# EasyEDA schematic LcsNodes-Main-Controller-Board-A.02.04.json
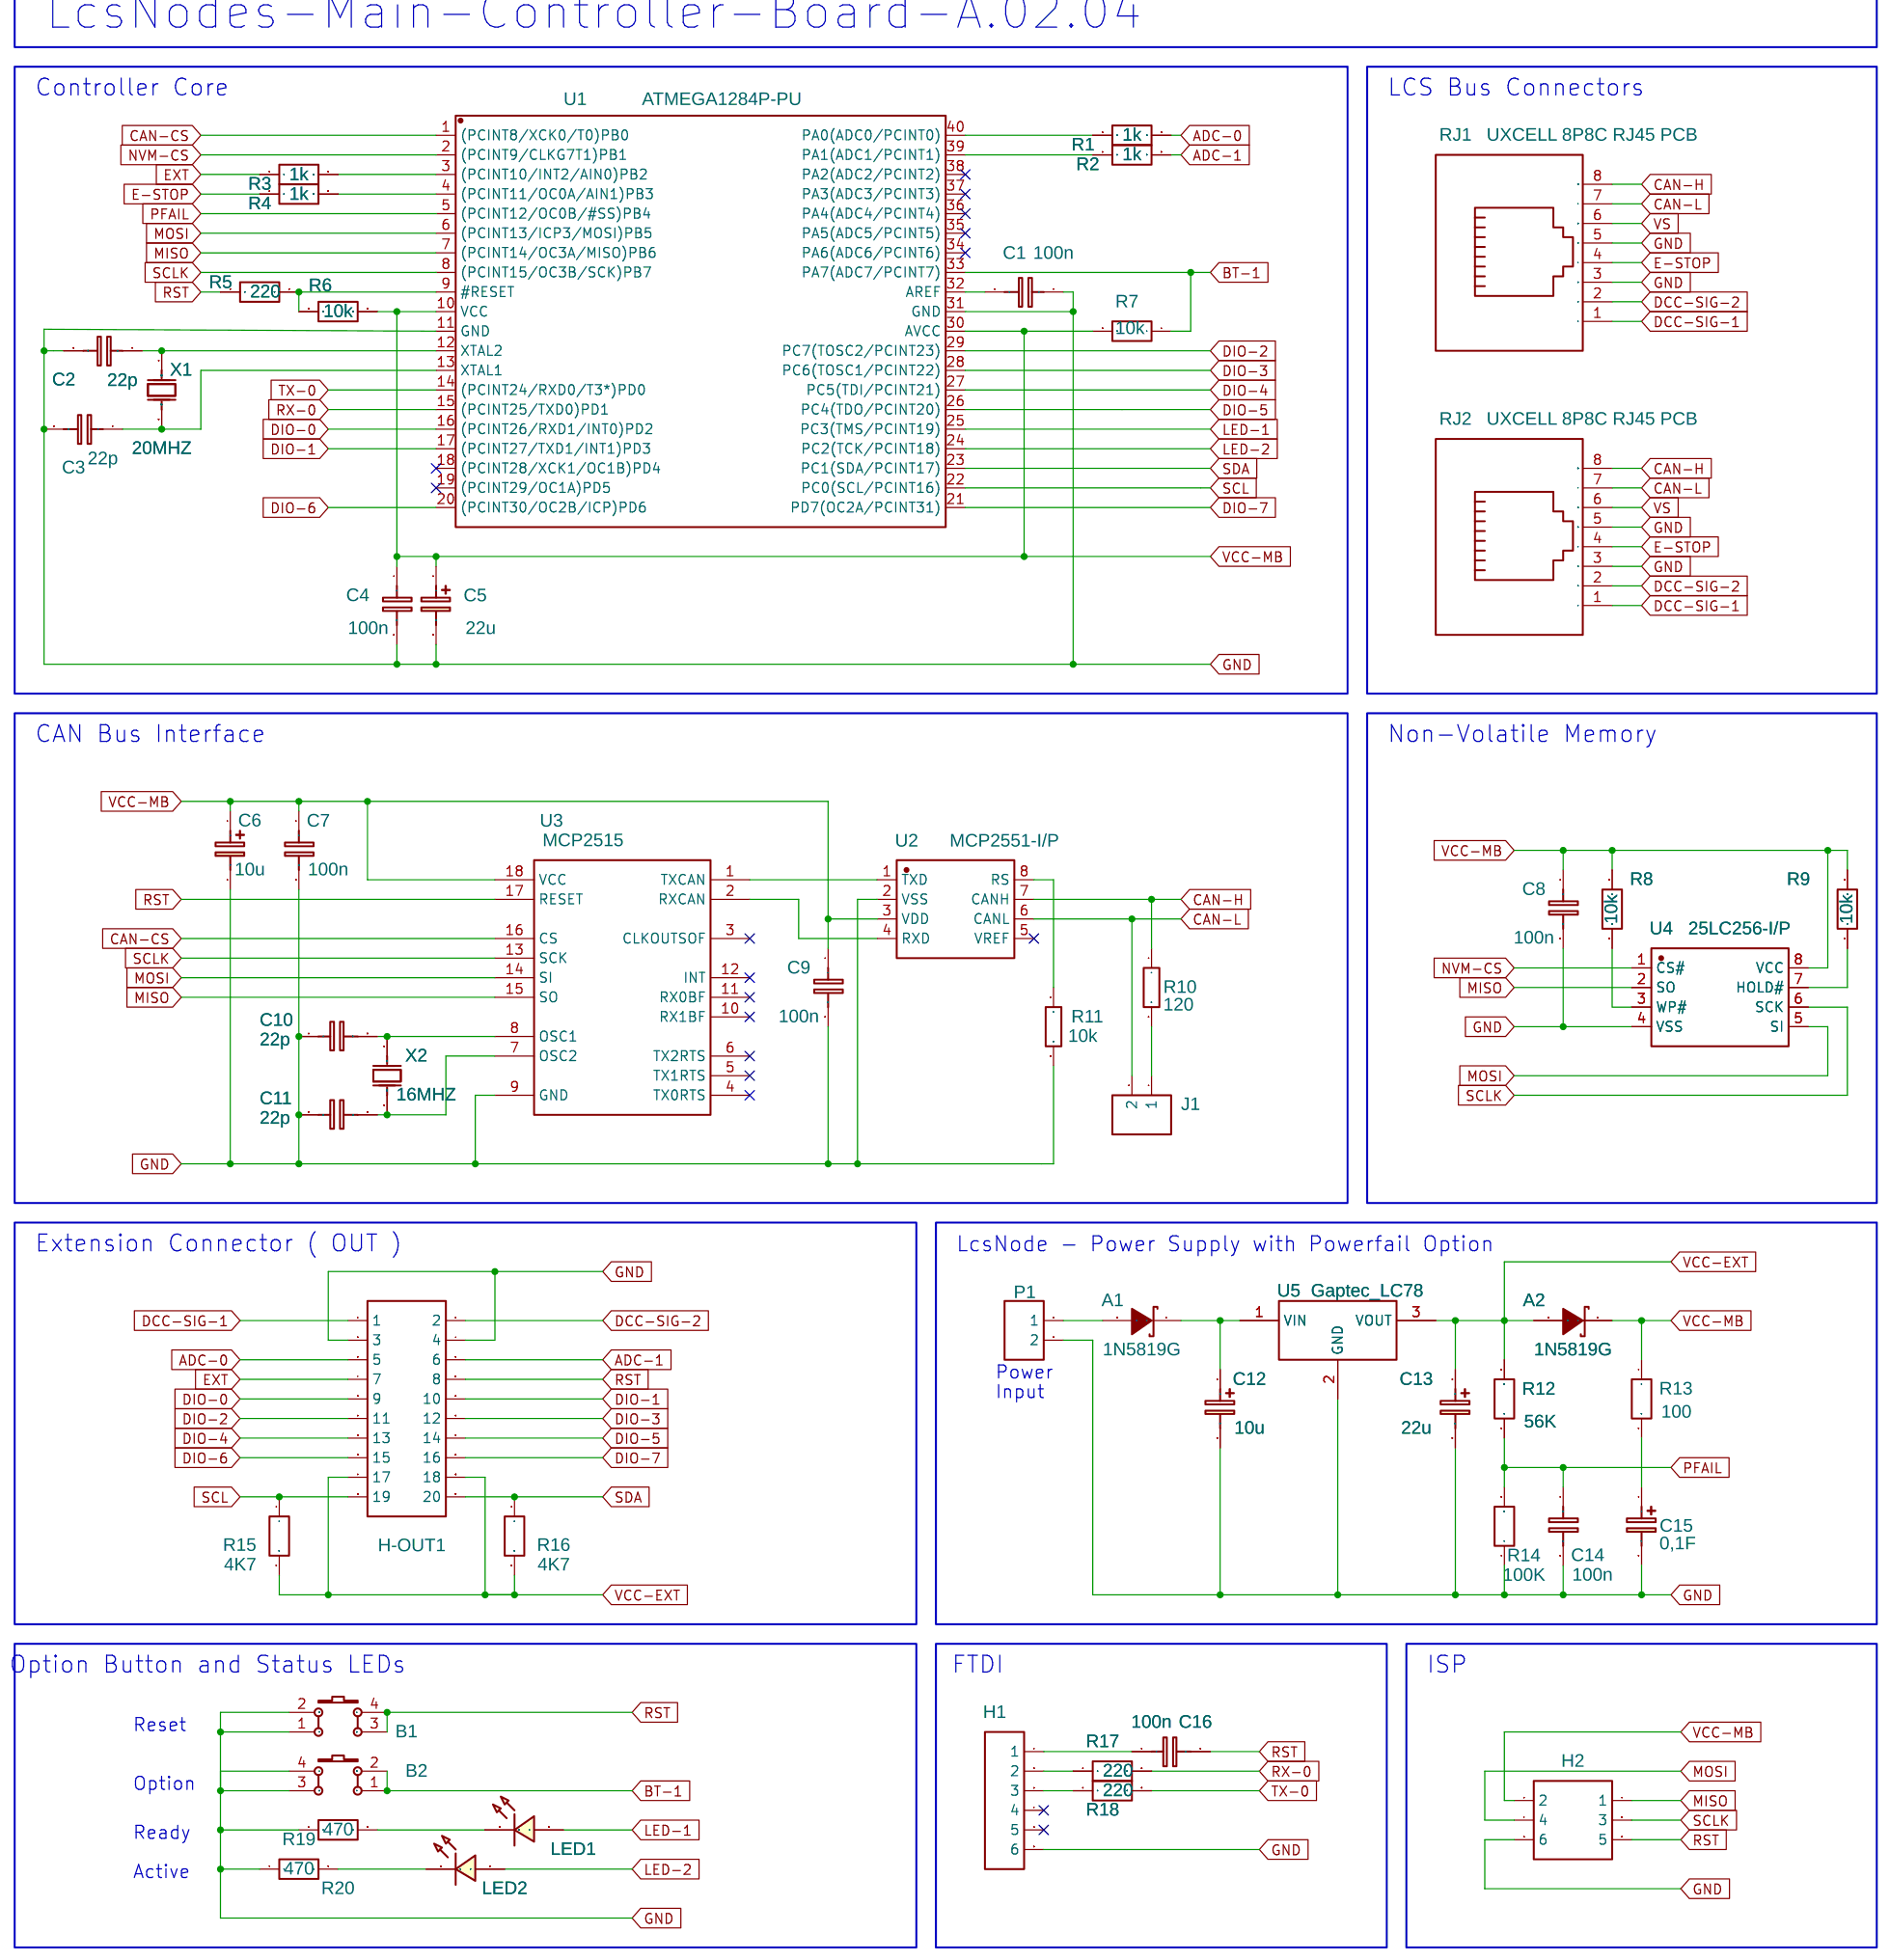
[diagram p0: schematic sheet]

## Parts
A1  1N5819G  [DO-41]
A2  1N5819G  [DO-41]
B1  Reset  [KEY-TH_4P-L6.0-W6.0-P4.50-LS6.5]
B2  Opt  [KEY-TH_4P-L6.0-W6.0-P4.50-LS6.5]
C1  100n  [RAD-0.1]
C2  22p  [RAD-0.1]
C3  22p  [RAD-0.1]
C4  100n  [RAD-0.1]
C5  22u  [CAP-D4.0×F1.5]
C6  10u  [CAP-D4.0×F1.5]
C7  100n  [RAD-0.1]
C8  100n  [RAD-0.1]
C9  100n  [RAD-0.1]
C10  22p  [RAD-0.1]
C11  22p  [RAD-0.1]
C12  10u  [CAP-D4.0×F1.5]
C13  22u  [CAP-D6.3×F2.5]
C14  100n  [RAD-0.1]
C15  0,1F  [CAP-D12.5XF5.0]
C16  100n  [RAD-0.1]
H1  HDR-F-2.54_1x6  [HDR-F-2.54_1X6]
H2  HDR-F-2.54_2x3  [HDR-F-2.54_2X3]
H-OUT1  HDR-F-2.54_2x10  [HDR-F-2.54_2X10]
J1  HDR-M-2.54_1x2  [HDR-M-2.54_1X2]
LED1  LED-TH-3mm_R  [LED-TH_BD3.0_RED]
LED2  LED-TH-3mm_R  [LED-TH_BD3.0_RED]
P1  CONN-TH_2P-P5.08  [CONN-TH_2P-P5.08]
R1  1k  [R_AXIAL-0.3]
R2  1k  [R_AXIAL-0.3]
R3  1k  [R_AXIAL-0.3]
R4  1k  [R_AXIAL-0.3]
R5  220  [R_AXIAL-0.3]
R6  10k  [R_AXIAL-0.3]
R7  10k  [R_AXIAL-0.3]
R8  10k  [R_AXIAL-0.3]
R9  10k  [R_AXIAL-0.3]
R10  120  [R_AXIAL-0.3]
R11  10k  [R_AXIAL-0.3]
R12  56K  [R_AXIAL-0.3]
R13  100  [R_AXIAL-0.3]
R14  100K  [R_AXIAL-0.3]
R15  4K7  [R_AXIAL-0.3]
R16  4K7  [R_AXIAL-0.3]
R17  220  [R_AXIAL-0.3]
R18  220  [R_AXIAL-0.3]
R19  470  [R_AXIAL-0.3]
R20  470  [R_AXIAL-0.3]
RJ1  UXCELL 8P8C RJ45 PCB  [UXCELL 8P8C RJ45 PCB]
RJ2  UXCELL 8P8C RJ45 PCB  [UXCELL 8P8C RJ45 PCB]
U1  ATMEGA1284P-PU  [PDIP-40_L52.3-W13.8-P2.54-LS15.24-BL]
U2  MCP2551-I/P  [PDIP-8_L9.3-W6.4-P2.54-LS7.6-BL]
U3  MCP2515  [18-DIP]
U4  25LC256-I/P  [PDIP-8_L9.3-W6.4-P2.54-LS7.6-BL]
U5  Gaptec_LC78  [GAPTEC_LC78]
X1  20MHZ  [OSC-49S-1]
X2  16MHZ  [OSC-49S-1]

## Library data of the parts
A1 A2 = 1N5819G: Diode Schottky 40V 1A Through Hole Axial; Supplier: Digi-Key; Supplier Part: 1N5819GOS-ND; Manufacturer: ON Semiconductor; Contributor: James Bao; link: http://www.onsemi.com/pub/Collateral/1N5817-D.PDF
B1 B2 = K4-6×6_TH: Supplier: LCSC; Supplier Part: C136684; Manufacturer: 韩国韩荣; Manufacturer Part: K2-1102DP-E4SW-04; Contributor: LCEDA_Lib; Package Display: No
C1 = C_RAD-0.1_EU: Contributor: LCEDA_Lib; Package Display: No
C2-C4 C7-C11 C16 = C_0603_EU: Contributor: LCEDA_Lib; Package Display: No
C5 C6 C12 C13 = CE_TH_D4.0×F1.5_EU: Contributor: LCEDA_Lib
C14 = C_RAD-0.2_EU: Contributor: LCEDA_Lib
C15 = C_Tan_SMD_A_EU: Contributor: LCEDA_Lib
H1 = HDR-F-2.54_1x6: Supplier Part: C40877; Supplier: LCSC; Contributor: LCEDA_Lib
H2 = HDR-F-2.54_2x3: Supplier Part: C65114; Supplier: LCSC; Contributor: LCEDA_Lib
H-OUT1 = HDR-F-2.54_2x10: Supplier Part: C30867; Supplier: LCSC; Contributor: LCEDA_Lib
J1 = HDR-M-2.54_1x2: Supplier Part: C124375; Supplier: LCSC; Contributor: LCEDA_Lib
LED1 LED2 = LED-TH-3mm_R: Manufacturer: EVERLIGHT(台湾亿光); Manufacturer Part: 204-10SDRD/S530-A3-L; Supplier Part: C84774; Supplier: LCSC; Contributor: LCEDA_Lib; Package Display: No
P1 = CONN-TH_2P-P5.08: Supplier: LCSC; Contributor: LCEDA_Lib
R1-R9 R12-R20 = R_AXIAL-0.3_EU: Contributor: LCEDA_Lib
R10 R11 = RESISTOR-AXIAL-0.1
RJ1 RJ2 = UXCELL 8P8C RJ45 PCB: Supplier: LCSC; Supplier Part: C386758; Manufacturer: Shenzhen Cankemeng; Manufacturer Part: R-RJ45R10P-B000; Contributor: yalim; JLCPCB Part Class: Extended Part
U1 = ATMEGA1284P-PU: Supplier: LCSC; Supplier Part: C116839; Manufacturer: Microchip Tech; Contributor: LCSC; JLCPCB Part Class: Extended Part
U2 = MCP2551-I/P: Supplier: LCSC; Supplier Part: C411627; Manufacturer: Microchip Tech; Contributor: LCSC; JLCPCB Part Class: Extended Part
U3 = MCP2515: Microchip CAN Controller with SPI Interface; Manufacturer: Microchip; Contributor: samvanbrussel; Package Display: No
U4 = 25LC256-I/P: Supplier: LCSC; Supplier Part: C511271; Manufacturer: Microchip Tech; Contributor: LCSC; JLCPCB Part Class: Extended Part
U5 = Gaptec_LC78: Contributor: SpicyMemeBoi
X1 X2 = 16MHZ: EasyEDA: C16212; Supplier Part: C16212; Supplier: EasyEDA; Manufacturer: EasyEDA; Manufacturer Part: X49SD16MSD2SC

## Nets
GND: B1.1 B1.2 B2.3 B2.4 C1.1 C2.2 C3.2 C4.2 C5.2 C6.2 C7.2 C8.2 C9.2 C10.1 C11.1 C12.2 C13.2 C14.2 C15.2 H1.6 H2.6 H-OUT1.3 H-OUT1.4 P1.2 R11.2 R14.1 R19.1 R20.1 RJ1.3 RJ1.5 RJ2.3 RJ2.5 U1.11(GND) U1.31(GND) U2.2(VSS) U3.9(GND) U4.4(VSS) U5.2(GND)
VCC-EXT: A2.2(A) C13.1 H-OUT1.17 H-OUT1.18 R12.2 R15.2 R16.2 U5.3(VOUT)
VCC-MB: A2.1(K) C4.1 C5.1 C6.1 C7.1 C8.1 C9.1 H2.2 R6.2 R7.2 R8.1 R9.2 R13.1 U1.10(VCC) U1.30(AVCC) U2.3(VDD) U3.18(VCC) U4.8(VCC)
ADC-0: H-OUT1.5 R1.2
ADC-1: H-OUT1.6 R2.2
BT-1: B2.1 B2.2 R7.1 U1.33(PA7(ADC7/PCINT7))
CAN-CS: U1.1((PCINT8/XCK0/T0)PB0) U3.16(CS)
CAN-H: R10.1 RJ1.8 RJ2.8 U2.7(CANH)
CAN-L: J1.2 RJ1.7 RJ2.7 U2.6(CANL)
DCC-SIG-1: H-OUT1.1 RJ1.1 RJ2.1
DCC-SIG-2: H-OUT1.2 RJ1.2 RJ2.2
DIO-0: H-OUT1.9 U1.16((PCINT26/RXD1/INT0)PD2)
DIO-1: H-OUT1.10 U1.17((PCINT27/TXD1/INT1)PD3)
DIO-2: H-OUT1.11 U1.29(PC7(TOSC2/PCINT23))
DIO-3: H-OUT1.12 U1.28(PC6(TOSC1/PCINT22))
DIO-4: H-OUT1.13 U1.27(PC5(TDI/PCINT21))
DIO-5: H-OUT1.14 U1.26(PC4(TDO/PCINT20))
DIO-6: H-OUT1.15 U1.20((PCINT30/OC2B/ICP)PD6)
DIO-7: H-OUT1.16 U1.21(PD7(OC2A/PCINT31))
E-STOP: R4.1 RJ1.4 RJ2.4
EXT: H-OUT1.7 R3.1
LED-1: LED1.1 U1.25(PC3(TMS/PCINT19))
LED-2: LED2.1 U1.24(PC2(TCK/PCINT18))
MISO: H2.1 U1.7((PCINT14/OC3A/MISO)PB6) U3.15(SO) U4.2(SO)
MOSI: H2.4 U1.6((PCINT13/ICP3/MOSI)PB5) U3.14(SI) U4.5(SI)
NVM-CS: U1.2((PCINT9/CLKG7T1)PB1) U4.1(CS#)
PFAIL: C14.1 R12.1 R14.2 U1.5((PCINT12/OC0B/#SS)PB4)
RST: B1.3 B1.4 C16.2 H2.5 H-OUT1.8 R5.1 U3.17(RESET)
RX-0: R17.2 U1.15((PCINT25/TXD0)PD1)
SCL: H-OUT1.19 R15.1 U1.22(PC0(SCL/PCINT16))
SCLK: H2.3 U1.8((PCINT15/OC3B/SCK)PB7) U3.13(SCK) U4.6(SCK)
SDA: H-OUT1.20 R16.1 U1.23(PC1(SDA/PCINT17))
TX-0: R18.2 U1.14((PCINT24/RXD0/T3*)PD0)
VS: RJ1.6 RJ2.6
Net-(A1-1): A1.1(K) C12.1 U5.1(VIN)
Net-(A1-2): A1.2(A) P1.1
Net-(C1-2): C1.2 U1.32(AREF)
Net-(C2-1): C2.1 U1.12(XTAL2) X1.1(OSC1)
Net-(C3-1): C3.1 U1.13(XTAL1) X1.2(OSC2)
Net-(C10-2): C10.2 U3.8(OSC1) X2.1(OSC1)
Net-(C11-2): C11.2 U3.7(OSC2) X2.2(OSC2)
Net-(C15-1): C15.1 R13.2
Net-(C16-1): C16.1 H1.1
Net-(H1-2): H1.2 R17.1
Net-(H1-3): H1.3 R18.1
Net-(J1-1): J1.1 R10.2
Net-(LED1-2): LED1.2 R19.2
Net-(LED2-2): LED2.2 R20.2
Net-(R1-1): R1.1 U1.40(PA0(ADC0/PCINT0))
Net-(R2-1): R2.1 U1.39(PA1(ADC1/PCINT1))
Net-(R3-2): R3.2 U1.3((PCINT10/INT2/AIN0)PB2)
Net-(R4-2): R4.2 U1.4((PCINT11/OC0A/AIN1)PB3)
Net-(R5-2): R5.2 R6.1 U1.9(#RESET)
Net-(R8-2): R8.2 U4.3(WP#)
Net-(R9-1): R9.1 U4.7(HOLD#)
Net-(R11-1): R11.1 U2.8(RS)
Net-(U2-1): U2.1(TXD) U3.1(TXCAN)
Net-(U2-4): U2.4(RXD) U3.2(RXCAN)

Not connected (* = marked no-connect by the designer): H1 4* 5*; U1 18((PCINT28/XCK1/OC1B)PD4)* 19((PCINT29/OC1A)PD5)* 34(PA6(ADC6/PCINT6))* 35(PA5(ADC5/PCINT5))* 36(PA4(ADC4/PCINT4))* 37(PA3(ADC3/PCINT3))* 38(PA2(ADC2/PCINT2))*; U2 5(VREF)*; U3 3(CLKOUTSOF)* 4(TX0RTS)* 5(TX1RTS)* 6(TX2RTS)* 10(RX1BF)* 11(RX0BF)* 12(INT)*

## Notes on the sheet
- LcsNodes-Main-Controller-Board-A.02.04
- Controller Core
- LCS Bus Connectors
- CAN Bus Interface
- Non-Volatile Memory
- Extension Connector ( OUT )
- LcsNode - Power Supply with Powerfail Option
- Power
- Input
- Option Button and Status LEDs
- FTDI
- ISP
- Reset
- Option
- Ready
- Active
